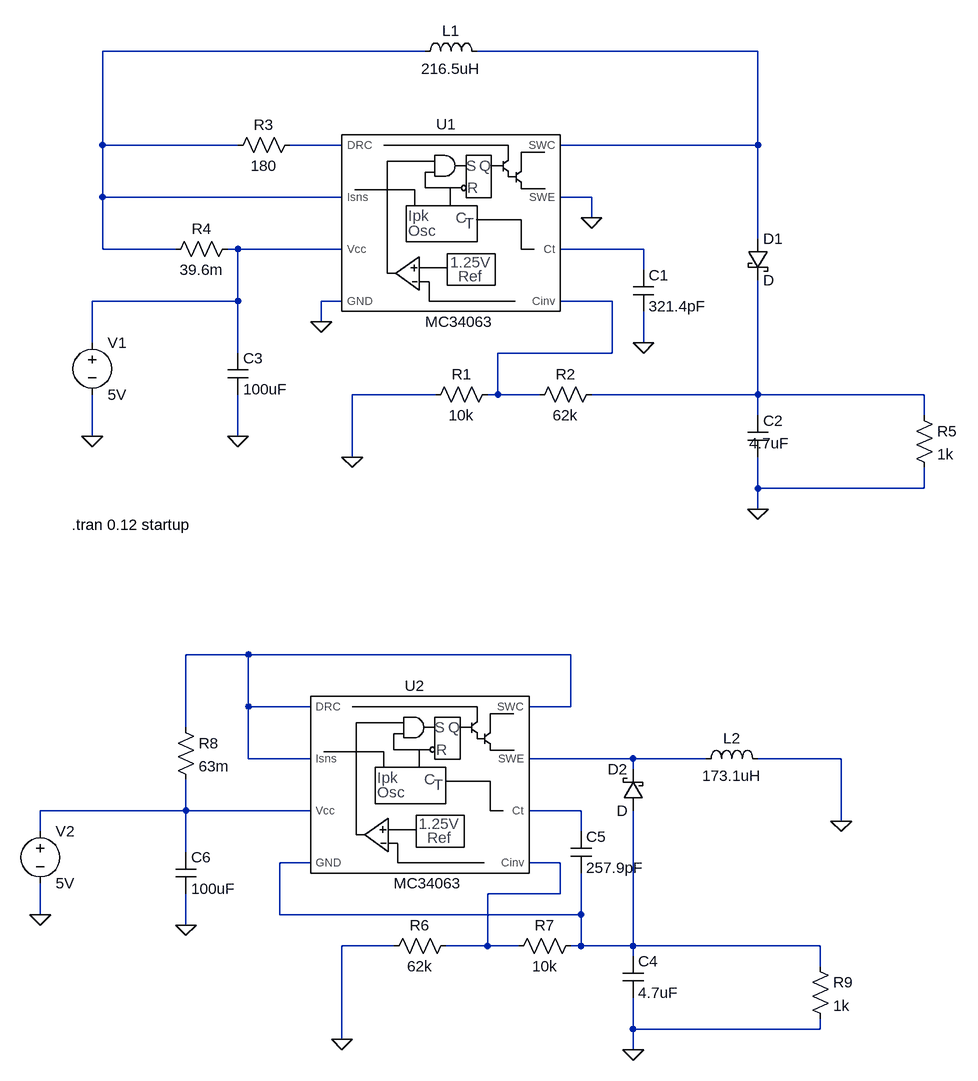
[diagram p0: schematic powersupplies.asc]
powersupplies.asc, the LTspice schematic file:
Version 4
SHEET 1 1208 1444
WIRE 192 -112 -304 -112
WIRE 704 -112 272 -112
WIRE -304 32 -304 -112
WIRE -96 32 -304 32
WIRE 64 32 -16 32
WIRE 704 32 704 -112
WIRE 704 32 400 32
WIRE -304 112 -304 32
WIRE 64 112 -304 112
WIRE 448 112 400 112
WIRE 448 144 448 112
WIRE 704 176 704 32
WIRE -304 192 -304 112
WIRE -192 192 -304 192
WIRE -96 192 -112 192
WIRE 64 192 -96 192
WIRE 528 192 400 192
WIRE 528 224 528 192
WIRE -96 272 -96 192
WIRE -96 272 -320 272
WIRE 64 272 32 272
WIRE 480 272 400 272
WIRE 32 304 32 272
WIRE -320 336 -320 272
WIRE 528 336 528 288
WIRE -96 352 -96 272
WIRE 480 352 480 272
WIRE 480 352 304 352
WIRE 208 416 80 416
WIRE 304 416 304 352
WIRE 304 416 288 416
WIRE 368 416 304 416
WIRE 704 416 704 240
WIRE 704 416 448 416
WIRE 960 416 704 416
WIRE 704 448 704 416
WIRE 960 448 960 416
WIRE -320 480 -320 416
WIRE -96 480 -96 416
WIRE 80 512 80 416
WIRE 704 560 704 512
WIRE 960 560 960 528
WIRE 960 560 704 560
WIRE 704 592 704 560
WIRE -80 816 -176 816
WIRE 416 816 -80 816
WIRE -80 896 -80 816
WIRE 16 896 -80 896
WIRE 416 896 416 816
WIRE 416 896 352 896
WIRE -176 928 -176 816
WIRE -80 976 -80 896
WIRE 16 976 -80 976
WIRE 512 976 352 976
WIRE 624 976 512 976
WIRE 832 976 704 976
WIRE 512 992 512 976
WIRE -176 1056 -176 1008
WIRE -176 1056 -400 1056
WIRE 16 1056 -176 1056
WIRE 432 1056 352 1056
WIRE 832 1072 832 976
WIRE -400 1088 -400 1056
WIRE 432 1088 432 1056
WIRE -176 1120 -176 1056
WIRE 16 1136 -32 1136
WIRE 400 1136 352 1136
WIRE 400 1184 400 1136
WIRE 400 1184 288 1184
WIRE -400 1216 -400 1168
WIRE -32 1216 -32 1136
WIRE 432 1216 432 1152
WIRE 432 1216 -32 1216
WIRE -176 1232 -176 1184
WIRE 144 1264 64 1264
WIRE 288 1264 288 1184
WIRE 288 1264 224 1264
WIRE 336 1264 288 1264
WIRE 432 1264 432 1216
WIRE 432 1264 416 1264
WIRE 512 1264 512 1056
WIRE 512 1264 432 1264
WIRE 800 1264 512 1264
WIRE 512 1280 512 1264
WIRE 800 1296 800 1264
WIRE 512 1392 512 1344
WIRE 800 1392 800 1376
WIRE 800 1392 512 1392
WIRE 64 1408 64 1264
WIRE 512 1424 512 1392
FLAG 448 144 0
FLAG 528 336 0
FLAG 80 512 0
FLAG 704 592 0
FLAG 32 304 0
FLAG -96 480 0
FLAG -320 480 0
FLAG -176 1232 0
FLAG 64 1408 0
FLAG 512 1424 0
FLAG 832 1072 0
FLAG -400 1216 0
SYMBOL MC34063 304 128 R0
SYMATTR InstName U1
SYMBOL res 304 400 R90
WINDOW 0 0 56 VBottom 2
WINDOW 3 32 56 VTop 2
SYMATTR InstName R1
SYMATTR Value 10k
SYMBOL res 464 400 R90
WINDOW 0 0 56 VBottom 2
WINDOW 3 32 56 VTop 2
SYMATTR InstName R2
SYMATTR Value 62k
SYMBOL cap 512 224 R0
SYMATTR InstName C1
SYMATTR Value 321.4pF
SYMBOL cap 688 448 R0
WINDOW 3 3 43 Left 2
SYMATTR Value 4.7uF
SYMATTR InstName C2
SYMBOL schottky 688 176 R0
SYMATTR InstName D1
SYMBOL ind 176 -96 R270
WINDOW 0 32 56 VTop 2
WINDOW 3 5 56 VBottom 2
SYMATTR InstName L1
SYMATTR Value 216.5uH
SYMBOL res 0 16 R90
WINDOW 0 0 56 VBottom 2
WINDOW 3 32 56 VTop 2
SYMATTR InstName R3
SYMATTR Value 180
SYMBOL res -96 176 R90
WINDOW 0 0 56 VBottom 2
WINDOW 3 32 56 VTop 2
SYMATTR InstName R4
SYMATTR Value 39.6m
SYMBOL cap -112 352 R0
SYMATTR InstName C3
SYMATTR Value 100uF
SYMBOL voltage -320 320 R0
WINDOW 123 0 0 Left 2
WINDOW 39 0 0 Left 2
SYMATTR InstName V1
SYMATTR Value 5V
SYMBOL res 944 432 R0
SYMATTR InstName R5
SYMATTR Value 1k
SYMBOL MC34063 256 992 R0
SYMATTR InstName U2
SYMBOL res 240 1248 R90
WINDOW 0 0 56 VBottom 2
WINDOW 3 32 56 VTop 2
SYMATTR InstName R6
SYMATTR Value 62k
SYMBOL res 432 1248 R90
WINDOW 0 0 56 VBottom 2
WINDOW 3 32 56 VTop 2
SYMATTR InstName R7
SYMATTR Value 10k
SYMBOL cap 496 1280 R0
SYMATTR InstName C4
SYMATTR Value 4.7uF
SYMBOL schottky 528 1056 R180
WINDOW 0 24 64 Left 2
WINDOW 3 24 0 Left 2
SYMATTR InstName D2
SYMBOL cap 416 1088 R0
SYMATTR InstName C5
SYMATTR Value 257.9pF
SYMBOL ind 608 992 R270
WINDOW 0 32 56 VTop 2
WINDOW 3 5 56 VBottom 2
SYMATTR InstName L2
SYMATTR Value 173.1uH
SYMBOL res -192 912 R0
SYMATTR InstName R8
SYMATTR Value 63m
SYMBOL cap -192 1120 R0
SYMATTR InstName C6
SYMATTR Value 100uF
SYMBOL res 784 1280 R0
SYMATTR InstName R9
SYMATTR Value 1k
SYMBOL voltage -400 1072 R0
WINDOW 123 0 0 Left 2
WINDOW 39 0 0 Left 2
SYMATTR InstName V2
SYMATTR Value 5V
TEXT -352 616 Left 2 !.tran 0.12 startup

The netlist it stands for:
* powersupplies.asc
XU1 N002 0 N005 0 N006 N004 N001 N003 MC34063  ; pins SWC SWE Ct GND Cinv Vcc Isns DRC
R1 N006 0 10k
R2 N007 N006 62k
C1 N005 0 321.4pF
C2 N007 0 4.7uF
D1 N002 N007 D
L1 N001 N002 216.5uH
R3 N003 N001 180
R4 N004 N001 39.6m
C3 N004 0 100uF
V1 N004 0 5V
R5 N007 0 1k
XU2 N008 N009 N011 N012 N013 N010 N008 N008 MC34063  ; pins SWC SWE Ct GND Cinv Vcc Isns DRC
R6 N013 0 62k
R7 N012 N013 10k
C4 N012 0 4.7uF
D2 N012 N009 D
C5 N011 N012 257.9pF
L2 N009 0 173.1uH
R8 N008 N010 63m
C6 N010 0 100uF
R9 N012 0 1k
V2 N010 0 5V
.model D D
.lib standard.dio
.tran 0.12 startup
.lib MC34063.sub
.backanno
.end